# Altium schematic sheet MainPCB.SchDoc
size A; SheetNumber: 1; SheetTotal: 5
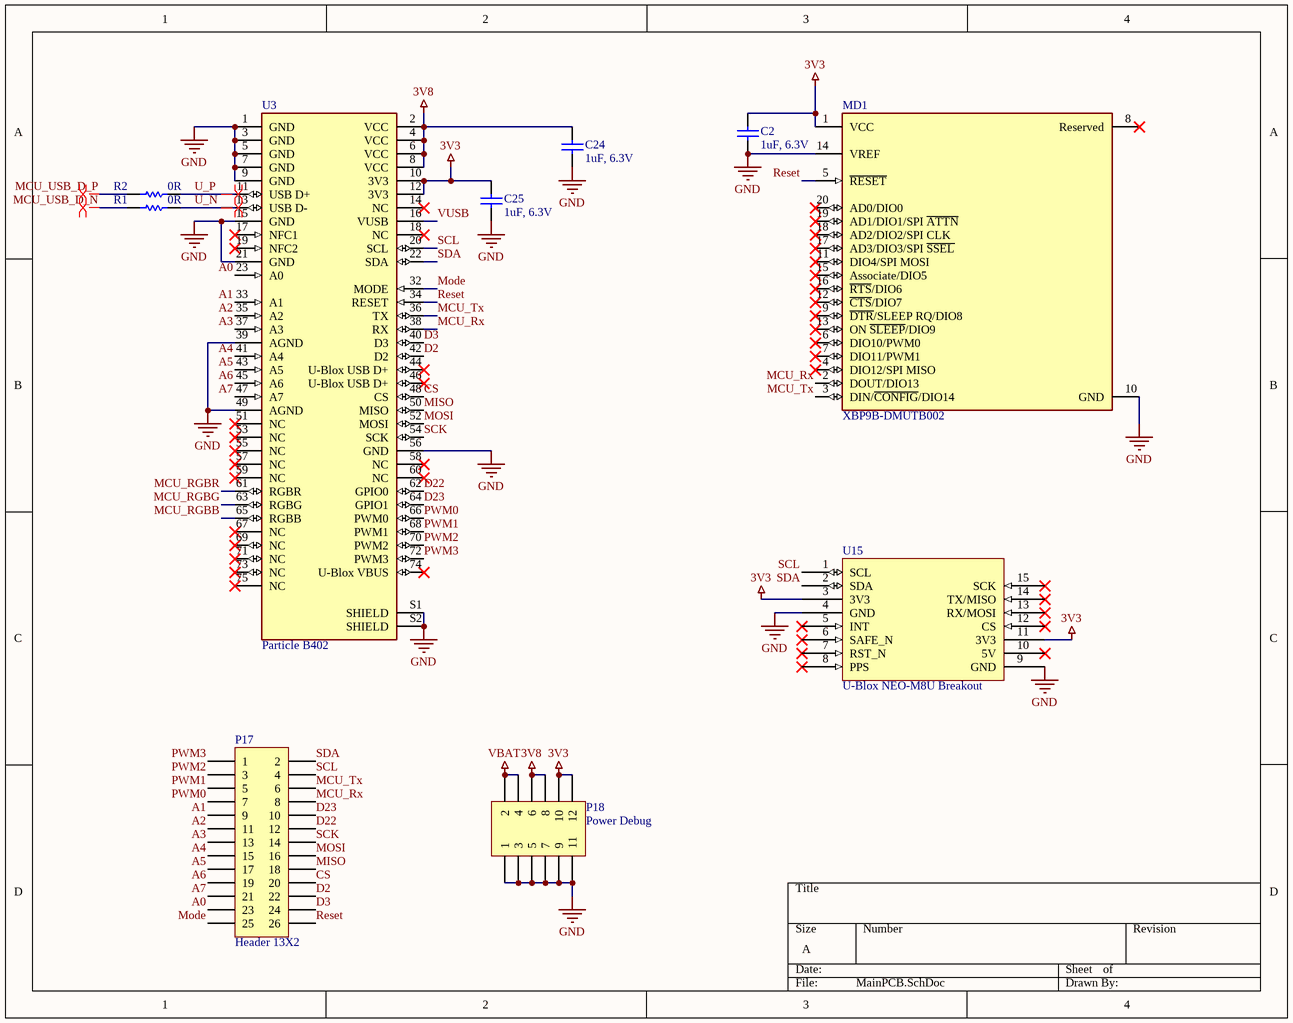
[diagram p0: MainPCB.SchDoc]

## Parts
C2  value 1uF, 6.3V  [ANTC1608X90N]  (hidden comment: Capacitor)
C24  value 1uF, 6.3V  [ANTC1608X90N]  (hidden comment: Capacitor)
C25  value 1uF, 6.3V  [ANTC1608X90N]  (hidden comment: Capacitor)
MD1  XBP9B-DMUTB002  [FP-XBP9B-DMUTB002-MFG]
P17  Header 13X2  [HDR2X13]
P18  Power Debug  [HDR2X6]
R1  value 0R  [0603 Resistor]  (hidden comment: Resistor)
R2  value 0R  [0603 Resistor]  (hidden comment: Resistor)
U3  Supplier Part Number 1: Particle B402  [B402 Full]  (hidden comment: B402)
U15  U-Blox NEO-M8U Breakout  [U-Blox NEO-M8U]

## Nets
3V3: C2.2 C25.2 MD1.1(VCC) P18.10 P18.12 U3.10(3V3) U3.12(3V3) U15.3(3V3) U15.11(3V3)
3V8: C24.2 P18.6 P18.8 U3.2(VCC) U3.4(VCC) U3.6(VCC) U3.8(VCC)
GND: C2.1 C24.1 C25.1 MD1.10(GND) MD1.14(VREF) P18.1 P18.3 P18.5 P18.7 P18.9 P18.11 U3.1(GND) U3.3(GND) U3.5(GND) U3.7(GND) U3.9(GND) U3.15(GND) U3.21(GND) U3.39(AGND) U3.49(AGND) U3.56(GND) U3.S1(SHIELD) U3.S2(SHIELD) U15.4(GND) U15.9(GND)
VBAT: P18.2 P18.4
A0: P17.23 U3.23(A0)
A1: P17.9 U3.33(A1)
A2: P17.11 U3.35(A2)
A3: P17.13 U3.37(A3)
A4: P17.15 U3.41(A4)
A5: P17.17 U3.43(A5)
A6: P17.19 U3.45(A6)
A7: P17.21 U3.47(A7)
CS: P17.20 U3.48(CS)
D2: P17.22 U3.42(D2)
D3: P17.24 U3.40(D3)
D22: P17.12 U3.62(GPIO0)
D23: P17.10 U3.64(GPIO1)
MCU_RGBB: U3.65(RGBB)
MCU_RGBG: U3.63(RGBG)
MCU_RGBR: U3.61(RGBR)
MCU_Rx: MD1.2(DOUT/DIO13) P17.8 U3.38(RX)
MCU_Tx: MD1.3(DIN/~{CONFIG}/DIO14) P17.6 U3.36(TX)
MCU_USB_D_N: R1.1
MCU_USB_D_P: R2.1
MISO: P17.18 U3.50(MISO)
Mode: P17.25 U3.32(MODE)
MOSI: P17.16 U3.52(MOSI)
PWM0: P17.7 U3.66(PWM0)
PWM1: P17.5 U3.68(PWM1)
PWM2: P17.3 U3.70(PWM2)
PWM3: P17.1 U3.72(PWM3)
Reset: MD1.5(~{RESET}) P17.26 U3.34(RESET)
SCK: P17.14 U3.54(SCK)
SCL: P17.4 U3.20(SCL) U15.1(SCL)
SDA: P17.2 U3.22(SDA) U15.2(SDA)
U_N: R1.2 U3.13(USB_D-)
U_P: R2.2 U3.11(USB_D+)
VUSB: U3.16(VUSB)

Not connected (* = marked no-connect by the designer): MD1 4(DIO12/SPI_MISO)* 6(DIO10/PWM0)* 7(DIO11/PWM1)* 8(Reserved)* 9(~{DTR}/SLEEP_RQ/DIO8)* 11(DIO4/SPI_MOSI)* 12(~{CTS}/DIO7)* 13(ON_~{SLEEP}/DIO9)* 15(Associate/DIO5)* 16(~{RTS}/DIO6)* 17(AD3/DIO3/SPI_~{SSEL})* 18(AD2/DIO2/SPI_CLK)* 19(AD1/DIO1/SPI_~{ATTN})* 20(AD0/DIO0)*; U3 14(NC)* 17(NFC1)* 18(NC)* 19(NFC2)* 44(U-Blox_USB_D+)* 46(U-Blox_USB_D+)* 51(NC)* 53(NC)* 55(NC)* 57(NC)* 58(NC)* 59(NC)* 60(NC)* 67(NC)* 69(NC)* 71(NC)* 73(NC)* 74(U-Blox_VBUS)* 75(NC)*; U15 5(INT)* 6(SAFE_N)* 7(RST_N)* 8(PPS)* 10(5V)* 12(CS)* 13(RX/MOSI)* 14(TX/MISO)* 15(SCK)*

## Layout directives
differential pair: MCU_USB_D_N, MCU_USB_D_P, U_N, U_P

## Library data of the parts
C2 C24 C25 = Capacitor: SimulationGenericComponent: True
MD1 = CMP-84319-000004-1: RX TXRX MOD ISM < 1GHZ U.FL TH; Max Supply Voltage: 3.6V; Current - Transmitting: 215mA; Sensitivity: -101dBm; Min Frequency: 902MHz; Memory Size: 2KB; Max Frequency: 928MHz; Min Supply Voltage: 2.4V; Current - Receiving: 29mA; Interface: SPI; Data Rate: 200Kbps; Frequency: 900MHz; Output Power (dBm): 24dBm; Number of Pins: 20; Series: XBee-Pro™; Max Operating Temperature: 85°C; Radiation Hardening: No; Min Operating Temperature: -40°C; Package Quantity: 1; RAM Size: 2KB; Packaging: Bulk; Case/Package: Module
P17 = Header 13X2: Header, 13-Pin, Dual row; LatestRevisionDate: 17-Jul-2002; LatestRevisionNote: Re-released for DXP Platform.; Publisher: Altium Limited
P18 = Header 6X2: Header, 6-Pin, Dual row; LatestRevisionDate: 17-Jul-2002; LatestRevisionNote: Re-released for DXP Platform.; Publisher: Altium Limited
R1 R2 = Resistor: TC1: 0; SimulationGenericComponent: True; TC2: 0
U3 = B402: Connector, Backplane, Housing, Receptacle, 67 Position, 2row; MP: 2199230-4; Package: None; Availability: Unavailable; Value: *; Price: None; Supplier 1: Digi-Key
U15 = U-Blox NEO-M8U Breakout: GPS Board